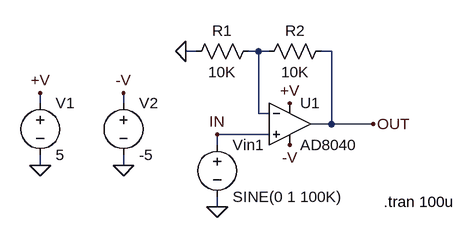
[diagram p0: schematic AD8040.asc]
AD8040.asc, the LTspice schematic file:
Version 4
SHEET 1 960 680
WIRE 272 128 256 128
WIRE 368 128 352 128
WIRE 384 128 368 128
WIRE 480 128 464 128
WIRE 32 208 32 192
WIRE 160 208 160 192
WIRE 368 224 368 128
WIRE 384 224 368 224
WIRE 480 240 480 128
WIRE 480 240 448 240
WIRE 544 240 480 240
WIRE 384 256 304 256
WIRE 304 272 304 256
WIRE 32 304 32 288
WIRE 160 304 160 288
WIRE 304 368 304 352
FLAG 32 192 +V
FLAG 304 368 0
FLAG 544 240 OUT
FLAG 304 256 IN
FLAG 416 208 +V
FLAG 160 192 -V
FLAG 416 272 -V
FLAG 256 128 0
FLAG 160 304 0
FLAG 32 304 0
SYMBOL voltage 32 192 R0
WINDOW 123 0 0 Left 2
WINDOW 39 0 0 Left 2
SYMATTR InstName V1
SYMATTR Value 5
SYMBOL voltage 304 256 R0
WINDOW 123 24 146 Left 2
WINDOW 39 24 125 Left 2
SYMATTR InstName Vin1
SYMATTR Value SINE(0 1 100K)
SYMBOL res 368 112 R90
WINDOW 0 0 56 VBottom 2
WINDOW 3 32 56 VTop 2
SYMATTR InstName R1
SYMATTR Value 10K
SYMBOL res 480 112 R90
WINDOW 0 0 56 VBottom 2
WINDOW 3 32 56 VTop 2
SYMATTR InstName R2
SYMATTR Value 10K
SYMBOL voltage 160 192 R0
WINDOW 123 24 146 Left 2
WINDOW 39 24 125 Left 2
SYMATTR InstName V2
SYMATTR Value -5
SYMBOL opamps\\AD8040 416 176 R0
SYMATTR InstName U1
TEXT 560 360 Left 2 !.tran 100u

The netlist it stands for:
* AD8040.asc
V1 +V 0 5
Vin1 IN 0 SINE(0 1 100K)
R1 N001 0 10K
R2 OUT N001 10K
V2 -V 0 -5
XU1 IN N001 +V -V OUT AD8040  ; pins In+ In- V+ V- OUT
.tran 100u
.backanno
.end